# Altium schematic sheet BUTTON.SchDoc
size 209 x 297 mm; SheetNumber: 23; SheetTotal: 23
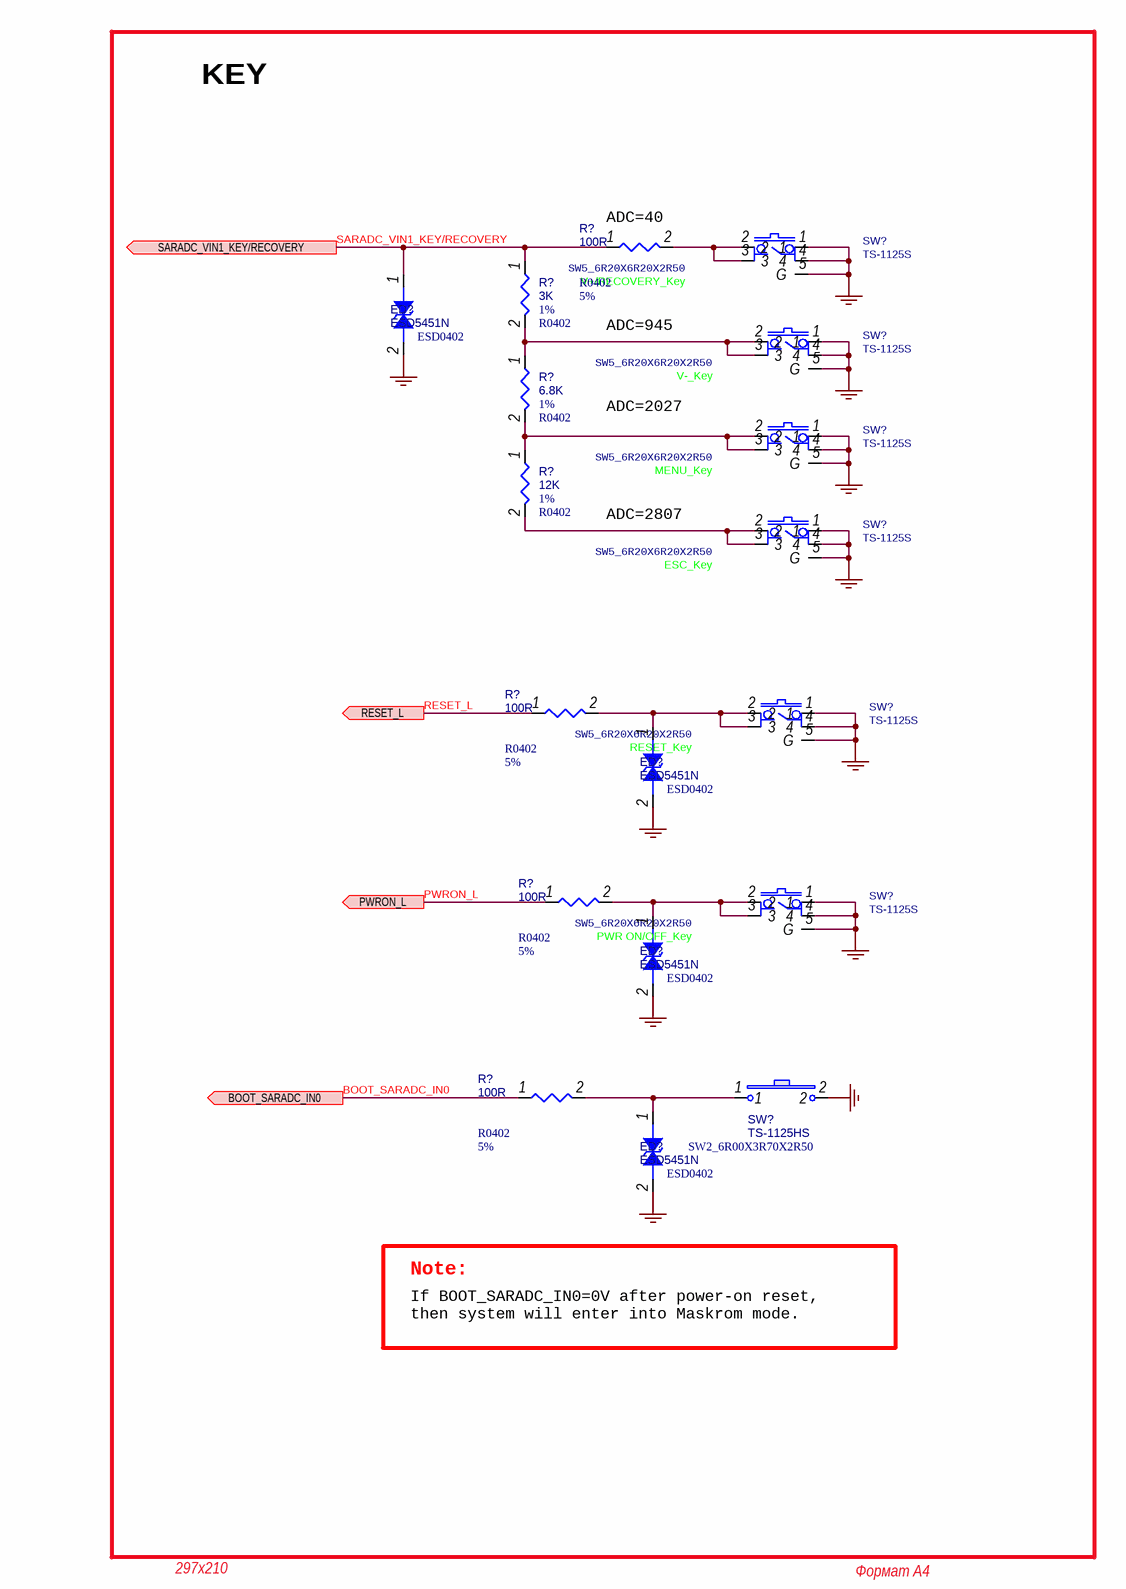
[diagram p0: BUTTON.SchDoc]

## Parts
(Parts that share a designator on the sheet are numbered #1, #2 ... from top to bottom, then left to right.)
ED?#1  ESD5451N  [ESD0402]
ED?#2  ESD5451N  [ESD0402]
ED?#3  ESD5451N  [ESD0402]
ED?#4  ESD5451N  [ESD0402]
R?#1  100R  Tolerance: 5%  [R0402]
R?#2  3K  Tolerance: 1%  [R0402]
R?#3  6.8K  Tolerance: 1%  [R0402]
R?#4  12K  Tolerance: 1%  [R0402]
R?#5  100R  Tolerance: 5%  [R0402]
R?#6  100R  Tolerance: 5%  [R0402]
R?#7  100R  Tolerance: 5%  [R0402]
SW?#1  TS-1125S  option: V+/RECOVERY_Key  [SW5_6R20X6R20X2R50]
SW?#2  TS-1125S  option: V-_Key  [SW5_6R20X6R20X2R50]
SW?#3  TS-1125S  option: MENU_Key  [SW5_6R20X6R20X2R50]
SW?#4  TS-1125S  option: ESC_Key  [SW5_6R20X6R20X2R50]
SW?#5  TS-1125S  option: RESET_Key  [SW5_6R20X6R20X2R50]
SW?#6  TS-1125S  option: PWR ON/OFF_Key  [SW5_6R20X6R20X2R50]
SW?#7  TS-1125HS  PCB Footprint: SW2_6R00X3R70X2R50  [YC-6615B]

## Ports
BOOT_SARADC_IN0 (out, see RK3588_BOOTLOADER_MAYBE_SDIO[4B]), PWRON_L (out, see POWER_RK806[1A]), RESET_L (out, see POWER_RK806[1A], RK3588_OSC_PLL[4A]), SARADC_VIN1_KEY/RECOVERY (out, see RK3588_BOOTLOADER_MAYBE_SDIO[4B])

## Nets
GND: ED?#1.2 ED?#2.2 ED?#3.2 ED?#4.2 SW?#1.1 SW?#1.4 SW?#1.5(G) SW?#2.1 SW?#2.4 SW?#2.5(G) SW?#3.1 SW?#3.4 SW?#3.5(G) SW?#4.1 SW?#4.4 SW?#4.5(G) SW?#5.1 SW?#5.4 SW?#5.5(G) SW?#6.1 SW?#6.4 SW?#6.5(G) SW?#7.2
BOOT_SARADC_IN0: R?#7.1 ; port BOOT_SARADC_IN0
PWRON_L: R?#6.1 ; port PWRON_L
RESET_L: R?#5.1 ; port RESET_L
SARADC_VIN1_KEY/RECOVERY: ED?#1.1 R?#1.1 R?#2.1 ; port SARADC_VIN1_KEY/RECOVERY
NetED?#2_1: ED?#2.1 R?#5.2 SW?#5.2 SW?#5.3
NetED?#3_1: ED?#3.1 R?#6.2 SW?#6.2 SW?#6.3
NetED?#4_1: ED?#4.1 R?#7.2 SW?#7.1
NetR?#1_2: R?#1.2 SW?#1.2 SW?#1.3
NetR?#2_2: R?#2.2 R?#3.1 SW?#2.2 SW?#2.3
NetR?#3_2: R?#3.2 R?#4.1 SW?#3.2 SW?#3.3
NetR?#4_2: R?#4.2 SW?#4.2 SW?#4.3

## Notes on the sheet
- KEY
- (near R?#1) ADC=40
- ADC=945
- ADC=2027
- ADC=2807
- Note:
- If BOOT_SARADC_IN0=0V after power-on reset,
  then system will enter into Maskrom mode.
- 297x210
- Формат А4

## Library data of the parts
ED?#1 = DIODE BI_DIR TRIG: 1-Line, Bi-directional, Transient Voltage Suppressors.17.5pF.; Part Reference: ED9200; Manufacturer: WillSemi(О¤¶ы°лµјМе); Priority: A; PCB Footprint: ESD0402; Value: ESD5451N; Created by: JJJ; Manufacturer PN: ESD5451N; Part Type: ESD_TVS; RK PN: ESD5451N
ED?#2 = DIODE BI_DIR TRIG: 1-Line, Bi-directional, Transient Voltage Suppressors.17.5pF.; Part Reference: ED9201; Manufacturer: WillSemi(О¤¶ы°лµјМе); Priority: A; PCB Footprint: ESD0402; Value: ESD5451N; RK PN: ESD5451N; Part Type: ESD_TVS; Manufacturer PN: ESD5451N; Created by: JJJ
ED?#3 = DIODE BI_DIR TRIG: 1-Line, Bi-directional, Transient Voltage Suppressors.17.5pF.; Part Reference: ED9202; Manufacturer: WillSemi(О¤¶ы°лµјМе); Priority: A; PCB Footprint: ESD0402; Value: ESD5451N; Created by: JJJ; Manufacturer PN: ESD5451N; Part Type: ESD_TVS; RK PN: ESD5451N
ED?#4 = DIODE BI_DIR TRIG: 1-Line, Bi-directional, Transient Voltage Suppressors.17.5pF.; Part Reference: ED9203; Manufacturer: WillSemi(О¤¶ы°лµјМе); Priority: A; PCB Footprint: ESD0402; Value: ESD5451N; Created by: JJJ; Manufacturer PN: ESD5451N; Part Type: ESD_TVS; RK PN: ESD5451N
R?#1 = RESISTOR_Dup2: НЁУГєсД¤µзЧи,100R,+/-5%,R0402,1/16W.; Part Reference: R9200; Manufacturer PN: RC0402JR-07100RL; Manufacturer: YAGEO; Wattage: 1/16W; Priority: A; PCB Footprint: R0402; Value: 100R; Created by: YTL; Part Type: НЁУГєсД¤µзЧи; RK PN: RC0402JR-07100RL
R?#2 = RESISTOR_Dup2: НЁУГєсД¤µзЧи,3K,+/-1%,R0402,1/16W.; Part Reference: R9202; Manufacturer PN: RC0402FR-073KL; Manufacturer: YAGEO; Wattage: 1/16W; Priority: A; PCB Footprint: R0402; Value: 3K; Created by: YTL; Part Type: НЁУГєсД¤µзЧи; RK PN: RC0402FR-073KL
R?#3 = RESISTOR_Dup2: НЁУГєсД¤µзЧи,6K8,+/-1%,R0402,1/16W.; Part Reference: R9203; Manufacturer PN: RC0402FR-076K8L; Manufacturer: YAGEO; Wattage: 1/16W; Priority: A; PCB Footprint: R0402; Value: 6.8K; Created by: YTL; Part Type: НЁУГєсД¤µзЧи; RK PN: RC0402FR-076K8L
R?#4 = RESISTOR_Dup2: НЁУГєсД¤µзЧи,12K,+/-1%,R0402,1/16W.; Part Reference: R9205; Manufacturer PN: RC0402FR-0712KL; Manufacturer: YAGEO; Wattage: 1/16W; Priority: A; PCB Footprint: R0402; Value: 12K; Created by: YTL; Part Type: НЁУГєсД¤µзЧи; RK PN: RC0402FR-0712KL
R?#5 = RESISTOR_Dup2: НЁУГєсД¤µзЧи,100R,+/-5%,R0402,1/16W.; Part Reference: R9201; Manufacturer: YAGEO; RK PN: RC0402JR-07100RL; Priority: A; Wattage: 1/16W; PCB Footprint: R0402; Value: 100R; Part Type: НЁУГєсД¤µзЧи; Manufacturer PN: RC0402JR-07100RL; Created by: YTL
R?#6 = RESISTOR_Dup2: НЁУГєсД¤µзЧи,100R,+/-5%,R0402,1/16W.; Part Reference: R9204; Manufacturer PN: RC0402JR-07100RL; Manufacturer: YAGEO; Wattage: 1/16W; Priority: A; PCB Footprint: R0402; Value: 100R; Created by: YTL; Part Type: НЁУГєсД¤µзЧи; RK PN: RC0402JR-07100RL
R?#7 = RESISTOR_Dup2: НЁУГєсД¤µзЧи,100R,+/-5%,R0402,1/16W.; Part Reference: R9206; Manufacturer: YAGEO; RK PN: RC0402JR-07100RL; Priority: A; Wattage: 1/16W; PCB Footprint: R0402; Value: 100R; Part Type: НЁУГєсД¤µзЧи; Manufacturer PN: RC0402JR-07100RL; Created by: YTL
SW?#1 = KEY_5PIN: 5ЅЕМщЖ¬Ј¬6.2MMx6.2MM°ґјь; Part Reference: SW9200; Manufacturer: Сw»ЄµзЧУ; Priority: A; Value: TS-1125S; PCB Footprint: SW5_6R20X6R20X2R50; RK PN: TS-1125S; Part Type: KEY; Manufacturer Part Number: TS-1125S; Created by: YWQ
SW?#2 = KEY_5PIN: 5ЅЕМщЖ¬Ј¬6.2MMx6.2MM°ґјь; Part Reference: SW9202; Manufacturer: Сw»ЄµзЧУ; Priority: A; Value: TS-1125S; PCB Footprint: SW5_6R20X6R20X2R50; RK PN: TS-1125S; Part Type: KEY; Manufacturer Part Number: TS-1125S; Created by: YWQ
SW?#3 = KEY_5PIN: 5ЅЕМщЖ¬Ј¬6.2MMx6.2MM°ґјь; Part Reference: SW9203; Manufacturer: Сw»ЄµзЧУ; Priority: A; Value: TS-1125S; PCB Footprint: SW5_6R20X6R20X2R50; RK PN: TS-1125S; Part Type: KEY; Manufacturer Part Number: TS-1125S; Created by: YWQ
SW?#4 = KEY_5PIN: 5ЅЕМщЖ¬Ј¬6.2MMx6.2MM°ґјь; Part Reference: SW9205; Manufacturer: Сw»ЄµзЧУ; Priority: A; Value: TS-1125S; PCB Footprint: SW5_6R20X6R20X2R50; Created by: YWQ; Manufacturer Part Number: TS-1125S; Part Type: KEY; RK PN: TS-1125S
SW?#5 = KEY_5PIN: 5ЅЕМщЖ¬Ј¬6.2MMx6.2MM°ґјь; Part Reference: SW9201; Manufacturer: Сw»ЄµзЧУ; Priority: A; Value: TS-1125S; PCB Footprint: SW5_6R20X6R20X2R50; RK PN: TS-1125S; Part Type: KEY; Manufacturer Part Number: TS-1125S; Created by: YWQ
SW?#6 = KEY_5PIN: 5ЅЕМщЖ¬Ј¬6.2MMx6.2MM°ґјь; Part Reference: SW9204; Manufacturer: Сw»ЄµзЧУ; Priority: A; Value: TS-1125S; PCB Footprint: SW5_6R20X6R20X2R50; Created by: YWQ; Manufacturer Part Number: TS-1125S; Part Type: KEY; RK PN: TS-1125S
SW?#7 = KEY_2PIN: 2ЅЕМщЖ¬Ј¬6MMx3.7MM°ґјь; Part Reference: SW9206; Manufacturer: Сw»ЄµзЧУ; Priority: A; Value: TS-1125HS; RK PN: TS-1125HS; Part Type: KEY; Manufacturer Part Number: TS-1125HS; Created by: YWQ